# EAGLE schematic LC Meter (EAGLE 9.6.2)
Assembly variants: DNP
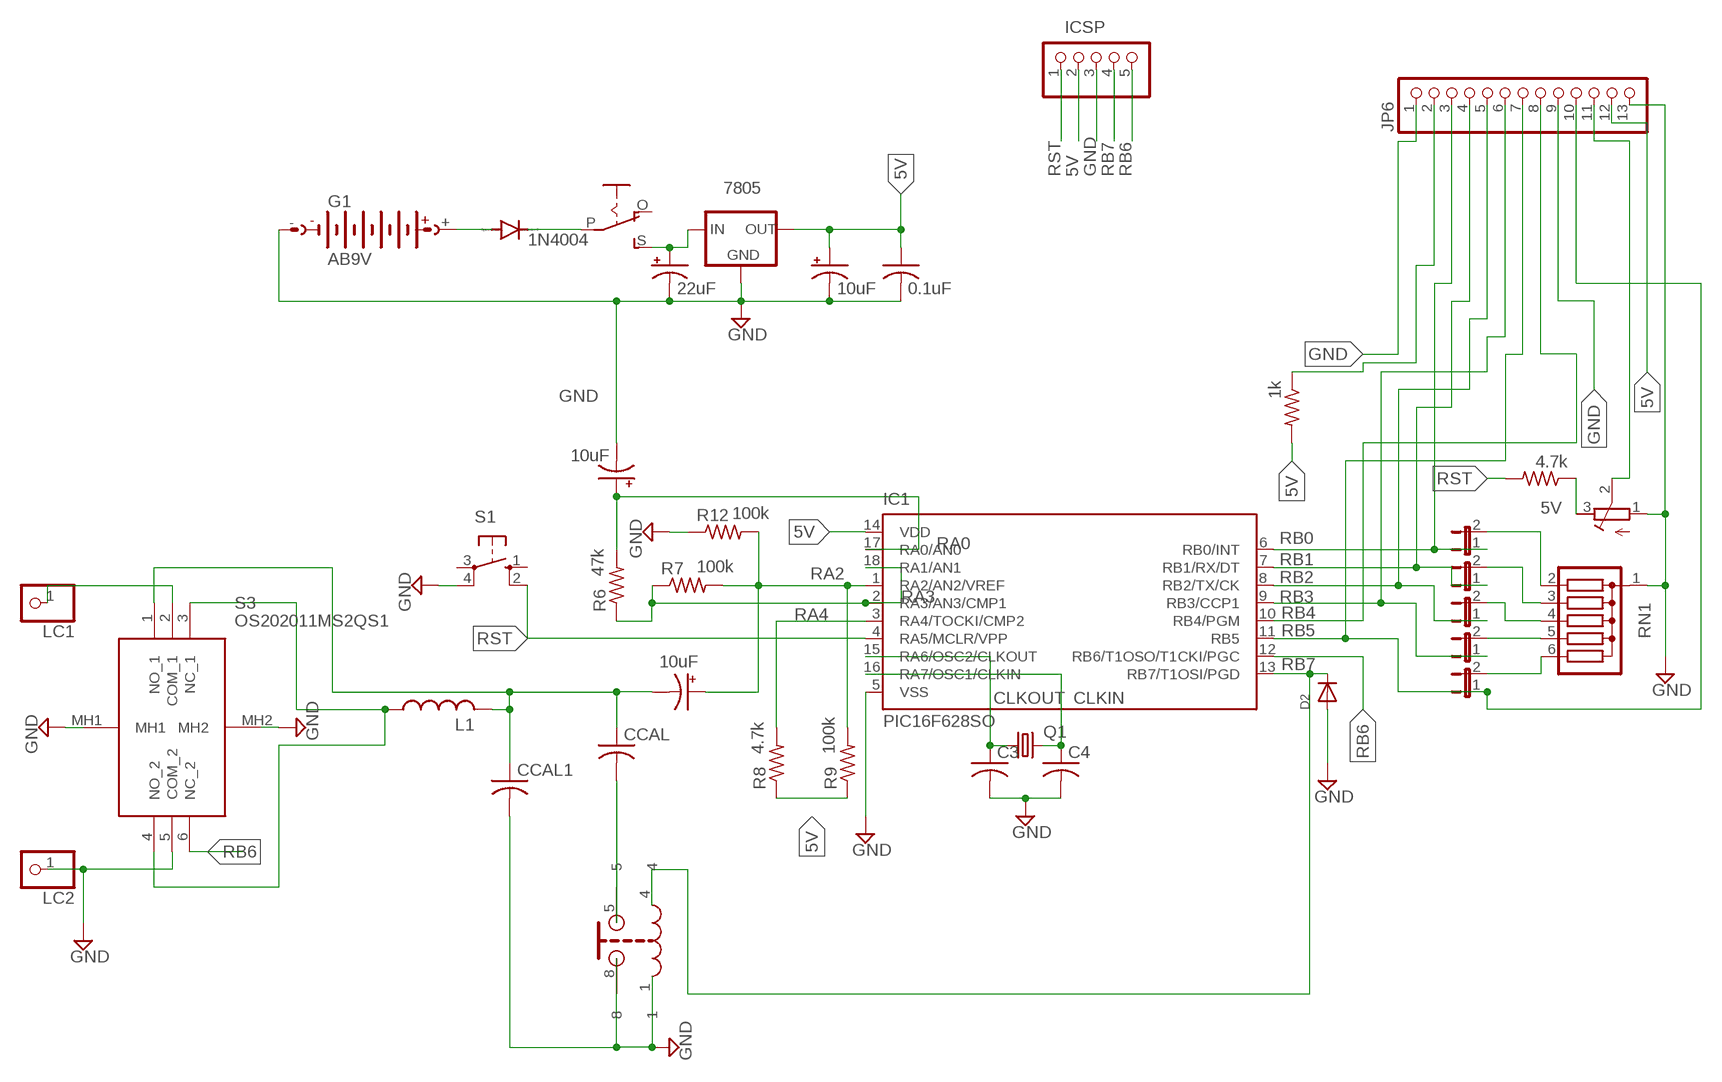
[diagram p0: schematic, sheet 1]

## Parts
C1  22uF  CPOL-USB/3528-21R  [B/3528-21R]
C2  0.1uF  C-USC0603  [C0603]
C3  C-USC0603  [C0603]
C4  C-USC0603  [C0603]
C5  10uF  CPOL-USE2-4  [E2-4]
C6  10uF  CPOL-USE2-4  [E2-4]
C7  10uF  CPOL-USE2-4  [E2-4]
CCAL  C-US050-035X075  [C050-035X075]
CCAL1  C-US050-035X075  [C050-035X075]
D1  1N4004  [DO41-10]
D2  DIODEDO-1N4148  [DO-1N4148]
G1  AB9V  [AB9V]
IC1  PIC16F628SO  [SO-18W]
ICSP  PINHD-1X5  [1X05]
JP1  JP1E  [JP1]
JP2  JP1E  [JP1]
JP3  JP1E  [JP1]
JP4  JP1E  [JP1]
JP5  JP1E  [JP1]
JP6  PINHD-1X13  [1X13]
L1  L-US0207/12  [0207/12]
LC1  PINHD-1X1  [1X01]
LC2  PINHD-1X1  [1X01]
Q1  CRYSTALHC49S  [HC49/S]
R1  1k  R-US_R0603  [R0603]
R6  47k  R-US_0204/7  [0204/7]
R7  100k  R-US_0204/7  [0204/7]
R8  4.7k  R-US_0204/7  [0204/7]
R9  100k  R-US_0204/7  [0204/7]
R10  4.7k  R-US_0204/7  [0204/7]
R11  R-TRIMM3339P  [RTRIM3339P]
R12  100k  R-US_0204/7  [0204/7]
REED  REEDRELAY  [COTO2204]
RN1  G05R  [SIL6]
S1  10-XX  [B3F-10XX]
S2  EG1218S  [EG1218]
S3  OS202011MS2QS1  [OS202011MS2QS1]
VREG  7805  78XXS  [78XXS]

## Nets
5V: C2.1 C6.+ IC1.14(VDD) ICSP.2 JP6.12 R1.2 R8.1 R9.1 R10.1 R11.3(E) VREG.OUT
CLKIN: C4.1 IC1.16(RA7/OSC1/CLKIN) Q1.2
CLKOUT: C3.1 IC1.15(RA6/OSC2/CLKOUT) Q1.1
GND: C1.- C2.2 C3.2 C4.2 C6.- C7.- CCAL1.2 D2.A G1.- IC1.5(VSS) ICSP.3 JP6.1 JP6.9 JP6.13 LC2.1 R11.1(A) R12.1 REED.1 REED.8 RN1.1 S1.4(P1) S3.5(COM_2) S3.MH1 S3.MH2 VREG.GND
N$1: JP5.2 RN1.6
N$2: CCAL.2 REED.5
N$3: C1.+ S2.S VREG.IN
N$4: D1.C S2.P
N$5: D1.A G1.+
N$7: C5.- CCAL1.1 CCAL.1 L1.2 S3.1(NO_1)
N$8: JP4.2 RN1.5
N$12: JP3.2 RN1.4
N$13: JP2.2 RN1.3
N$14: JP1.2 RN1.2
N$15: LC1.1 S3.2(COM_1)
N$22: L1.1 S3.3(NC_1) S3.4(NO_2)
N$23: JP6.11 R11.2(S)
N$31: JP6.2 R1.1
RA0: C7.+ IC1.17(RA0/AN0) R6.2
RA2: C5.+ IC1.1(RA2/AN2/VREF) R7.2 R9.2 R12.2
RA3: IC1.2(RA3/AN3/CMP1) IC1.18(RA1/AN1) R6.1 R7.1
RA4: IC1.3(RA4/TOCKI/CMP2) R8.2
RB0: IC1.6(RB0/INT) JP1.1 JP6.3
RB1: IC1.7(RB1/RX/DT) JP2.1 JP6.4
RB2: IC1.8(RB2/TX/CK) JP3.1 JP6.5
RB3: IC1.9(RB3/CCP1) JP4.1 JP6.6
RB4: IC1.10(RB4/PGM) JP6.8
RB5: IC1.11(RB5) JP5.1 JP6.7 JP6.10
RB6: IC1.12(RB6/T1OSO/T1CKI/PGC) ICSP.5 S3.6(NC_2)
RB7: D2.C IC1.13(RB7/T1OSI/PGD) ICSP.4 REED.4
RST: IC1.4(RA5/MCLR/VPP) ICSP.1 R10.2 S1.2(S1)
Unconnected: S1.1(S) S1.3(P) S2.O

## Library data of the parts
C1 = adafruit:CPOL-US: POLARIZED CAPACITOR, American symbol
C2-C4 CCAL CCAL1 = rcl:C-US: CAPACITOR, American symbol; SPICEPREFIX: C
C5-C7 = rcl:CPOL-US: POLARIZED CAPACITOR, American symbol; SPICEPREFIX: C
D1 = diode:1N4004: DIODE general purpose rectifier, 1 A
D2 = adafruit:DIODE: Diode SMADIODE - SMA Surface Mount Package 20V 1A Schottky Diode Digikey: 641-1014-6-ND DO-1N4148 - Through Hole Small Current Diode SOD-123 20V 1 A (.5mV Vf) Schottky Diode - Digikey: MBRX120TPMSCT-ND SOD-323 10V 570mA (.38mV Vf, 3ns) Schottky Diode - Digikey: ZLLS410CT-ND SOD-523 30V 30mA Schottky Diode (RB751S-40TE61) - Digikey: RB751S-40TE61CT-ND SOT23-R/W - SOT23 Package (R = Solder Paste/Reflow Ovens, W = Hand-Soldering) BAT54Film 40V 300mA - Digikey: 497-7162-1-ND
G1 = battery:AB9V: 9-V BATTERY CLIP
IC1 = microchip:PIC16F62*: FLASH-Based 8-Bit CMOS Microcontroller Source: http://ww1.microchip.com/downloads/en/DeviceDoc/40300C.pdf; MF: MICROCHIP; MPN: PIC16F628-20I/SO; OC_FARNELL: 9760415; OC_NEWARK: 23C4986
ICSP = pinhead:PINHD-1X5: PIN HEADER
JP1-JP5 = jumper:JP1E: JUMPER
JP6 = pinhead:PINHD-1X13: PIN HEADER
L1 = rcl:L-US: INDUCTOR, American symbol; SPICEPREFIX: L
LC1 LC2 = adafruit:PINHD-1X1: Pin header 1x1 for 0.1" spacing With round pins
Q1 = adafruit:CRYSTAL: CRYSTAL; OC_FARNELL: 1667008; OC_NEWARK: unknown
R1 R6-R10 R12 = rcl:R-US_: RESISTOR, American symbol; SPICEPREFIX: R
R11 = Custom Parts:R-TRIMM: Trimm resistor; SPICEMODEL: X; SPICEPREFIXL: POT
REED = Custom Parts:REEDRELAY
RN1 = resistor-sil:G05R: SIL RESISTOR; OC_FARNELL: unknown; OC_NEWARK: unknown
S1 = switch-omron:10-XX: OMRON SWITCH; MPN: B3F-1000; OC_FARNELL: 176432; OC_NEWARK: 36M3542
S2 = adafruit:EG1218: SLIDING SWITCH 0.1" spacing through hole, vertical SPDT slide switch http://www.ladyada.net/library/pcb/eaglelibrary.html
S3 = OS202011MS2QS1:OS202011MS2QS1: Switch Slide ON ON DPDT Top Slide 0.1A 12VDC 10000Cycles PC Pins Bracket Mount/Through Hole Bulk Source: Datasheet <https://www.mouser.com/datasheet/2/60/os-1382783.pdf>; ARROW_PART_NUMBER: OS202011MS2QS1; ARROW_PRICE-STOCK: https://www.arrow.com/en/products/os202011ms2qs1/ck; DESCRIPTION: Switch Slide ON ON DPDT Top Slide 0.1A 12VDC 10000Cycles PC Pins Bracket Mount/Through Hole Bulk; HEIGHT: 8.7mm; MANUFACTURER_NAME: C & K COMPONENTS; MANUFACTURER_PART_NUMBER: OS202011MS2QS1; MOUSER_PART_NUMBER: 611-OS202011MS2QS1; MOUSER_PRICE-STOCK: https://www.mouser.co.uk/ProductDetail/CK/OS202011MS2QS1/?qs=86ySKn7Oc5UsfQ5%2FN%252BBOEA%3D%3D
VREG = v-reg:78XXS: VOLTAGE REGULATOR